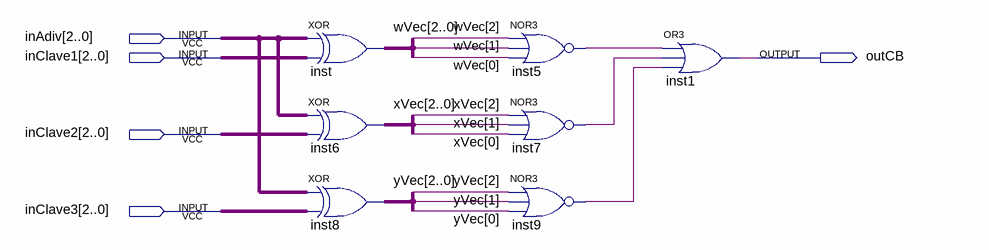
[diagram p0: schematic sheet]
// Quartus schematic COMPARA_B1D.bdf as structural Verilog: 7 symbols, 5 pins
module COMPARA_B1D (
  input  [2:0] inAdiv,
  input  [2:0] inClave1,
  input  [2:0] inClave2,
  input  [2:0] inClave3,
  output outCB
);

  wire inst5_out, inst7_out, inst9_out;
  wire [2:0] wVec, xVec, yVec;

  assign wVec = inAdiv ^ inClave1;  // XOR inst, 3 bits wide
  assign xVec = inAdiv ^ inClave2;  // XOR inst6, 3 bits wide
  assign yVec = inAdiv ^ inClave3;  // XOR inst8, 3 bits wide
  nor inst5 (inst5_out, wVec[2], wVec[1], wVec[0]);
  nor inst7 (inst7_out, xVec[2], xVec[1], xVec[0]);
  nor inst9 (inst9_out, yVec[2], yVec[1], yVec[0]);
  or inst1 (outCB, inst5_out, inst7_out, inst9_out);
endmodule
